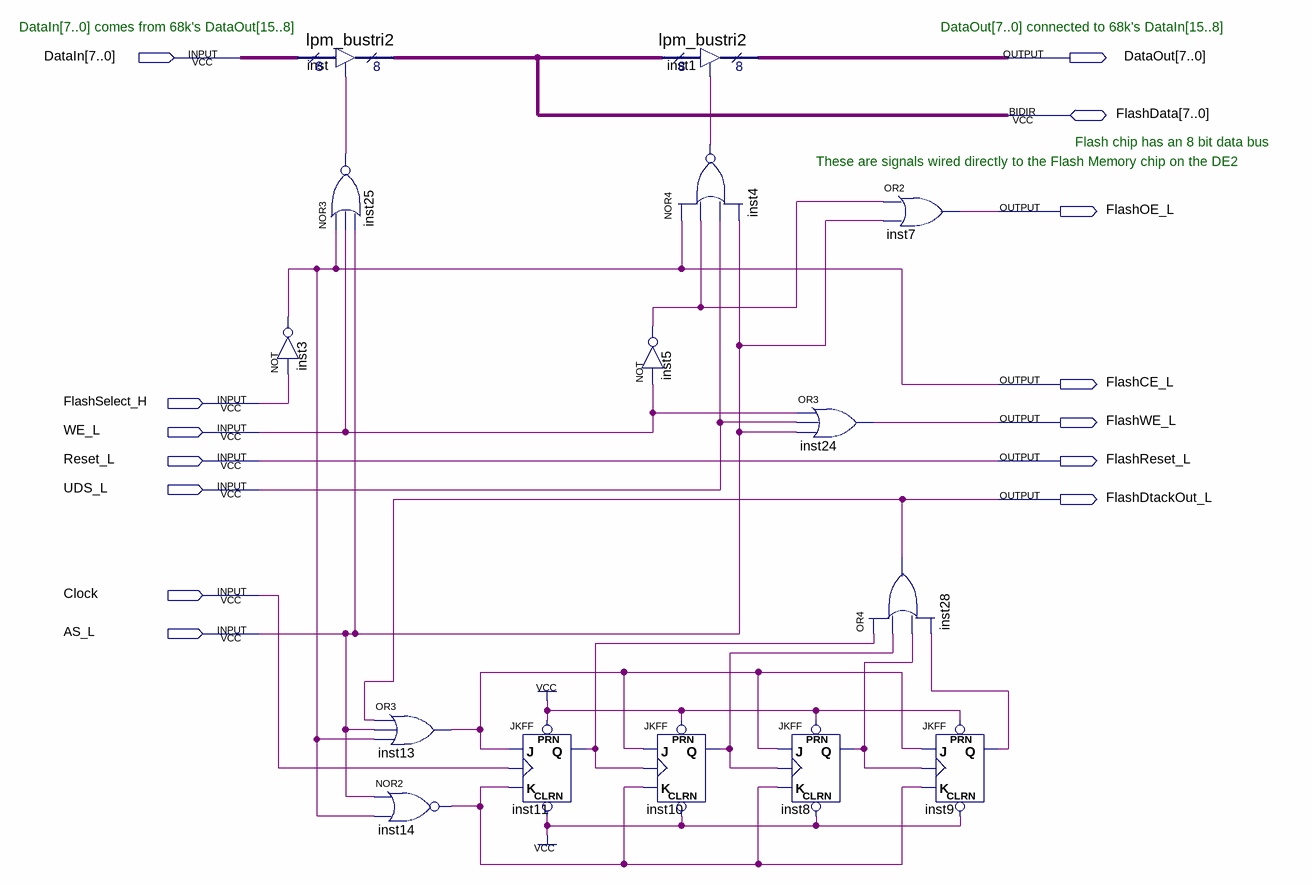
[diagram p0: schematic sheet]
// Quartus schematic FlashInterface.bdf as structural Verilog: 15 symbols, 14 pins
module FlashInterface (
  input  [7:0] DataIn,
  input  FlashSelect_H,
  input  WE_L,
  input  Reset_L,
  input  UDS_L,
  input  Clock,
  input  AS_L,
  inout  [7:0] FlashData,
  output [7:0] DataOut,
  output FlashOE_L,
  output FlashCE_L,
  output FlashWE_L,
  output FlashReset_L,
  output FlashDtackOut_L
);

  wire inst4_out, inst5_out, inst8_q, inst9_q, inst10_q, inst11_q, inst13_out, inst14_out, inst25_out;

  not inst3 (FlashCE_L, FlashSelect_H);
  lpm_bustri2 inst (.enabledt(inst25_out), .data(DataIn), .tridata(FlashData));
  nor inst25 (inst25_out, FlashCE_L, WE_L, AS_L);
  or inst13 (inst13_out, FlashDtackOut_L, AS_L, FlashCE_L);
  nor inst14 (inst14_out, AS_L, FlashCE_L);
  JKFF inst11 (.PRN(1'b1), .CLRN(1'b1), .K(inst14_out), .J(inst13_out), .CLK(Clock), .Q(inst11_q));
  lpm_bustri2 inst1 (.enabledt(inst4_out), .data(FlashData), .tridata(DataOut));
  nor inst4 (inst4_out, FlashCE_L, inst5_out, UDS_L, AS_L);
  not inst5 (inst5_out, WE_L);
  JKFF inst10 (.PRN(1'b1), .CLRN(1'b1), .K(inst14_out), .J(inst13_out), .CLK(inst11_q), .Q(inst10_q));
  or inst24 (FlashWE_L, WE_L, UDS_L, AS_L);
  JKFF inst8 (.PRN(1'b1), .CLRN(1'b1), .K(inst14_out), .J(inst13_out), .CLK(inst10_q), .Q(inst8_q));
  or inst7 (FlashOE_L, inst5_out, AS_L);
  or inst28 (FlashDtackOut_L, inst11_q, inst10_q, inst8_q, inst9_q);
  JKFF inst9 (.PRN(1'b1), .CLRN(1'b1), .K(inst14_out), .J(inst13_out), .CLK(inst8_q), .Q(inst9_q));

  assign FlashReset_L = Reset_L;

  // Notes on the sheet:
  //   DataIn[7..0] comes from 68k's DataOut[15..8]
  //   DataOut[7..0] connected to 68k's DataIn[15..8]
  //   Flash chip has an 8 bit data bus
  //   These are signals wired directly to the Flash Memory chip on the DE2
endmodule
